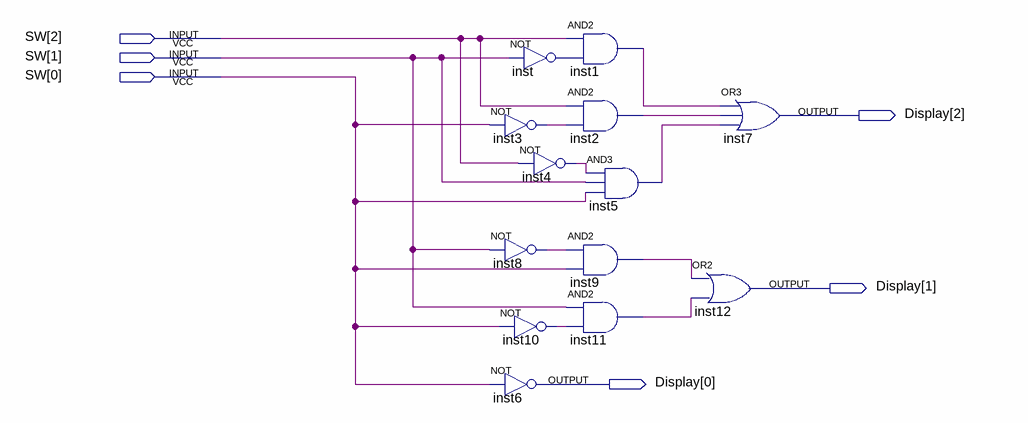
[diagram p0: schematic sheet]
// Quartus schematic INC.bdf as structural Verilog: 13 symbols, 6 pins
module INC (
  input  [2:0] SW,
  output [2:0] Display
);

  wire inst1_out, inst2_out, inst3_out, inst4_out, inst5_out, inst8_out, inst9_out, inst10_out, inst11_out,
       inst_out;

  not inst (inst_out, SW[1]);
  not inst3 (inst3_out, SW[0]);
  not inst4 (inst4_out, SW[2]);
  not inst8 (inst8_out, SW[1]);
  not inst10 (inst10_out, SW[0]);
  not inst6 (Display[0], SW[0]);
  and inst1 (inst1_out, SW[2], inst_out);
  and inst2 (inst2_out, SW[2], inst3_out);
  and inst5 (inst5_out, inst4_out, SW[1], SW[0]);
  and inst9 (inst9_out, inst8_out, SW[0]);
  and inst11 (inst11_out, SW[1], inst10_out);
  or inst7 (Display[2], inst1_out, inst2_out, inst5_out);
  or inst12 (Display[1], inst9_out, inst11_out);
endmodule
